# EasyEDA Pro project pcb easy eda pro stm32wb5mmg01 - Elektor.eprj, schematic Shield stm32wb5mm-dk
Create Date: 2023-10-27; Page Name: P1; Project Name: stm32wb5mmg01; Schematic Name: Shield stm32wb5mm-dk; Update Date: 2023-12-18; Company: A. ROMASZEWSKI; Drawed: EasyEDA Pro; Page Size: A4; Part Number: SHMMDK-002; Reviewed: EasyEDA Pro; Version: V0.1; attr-text: ADS1115 ADR I2C 0x76
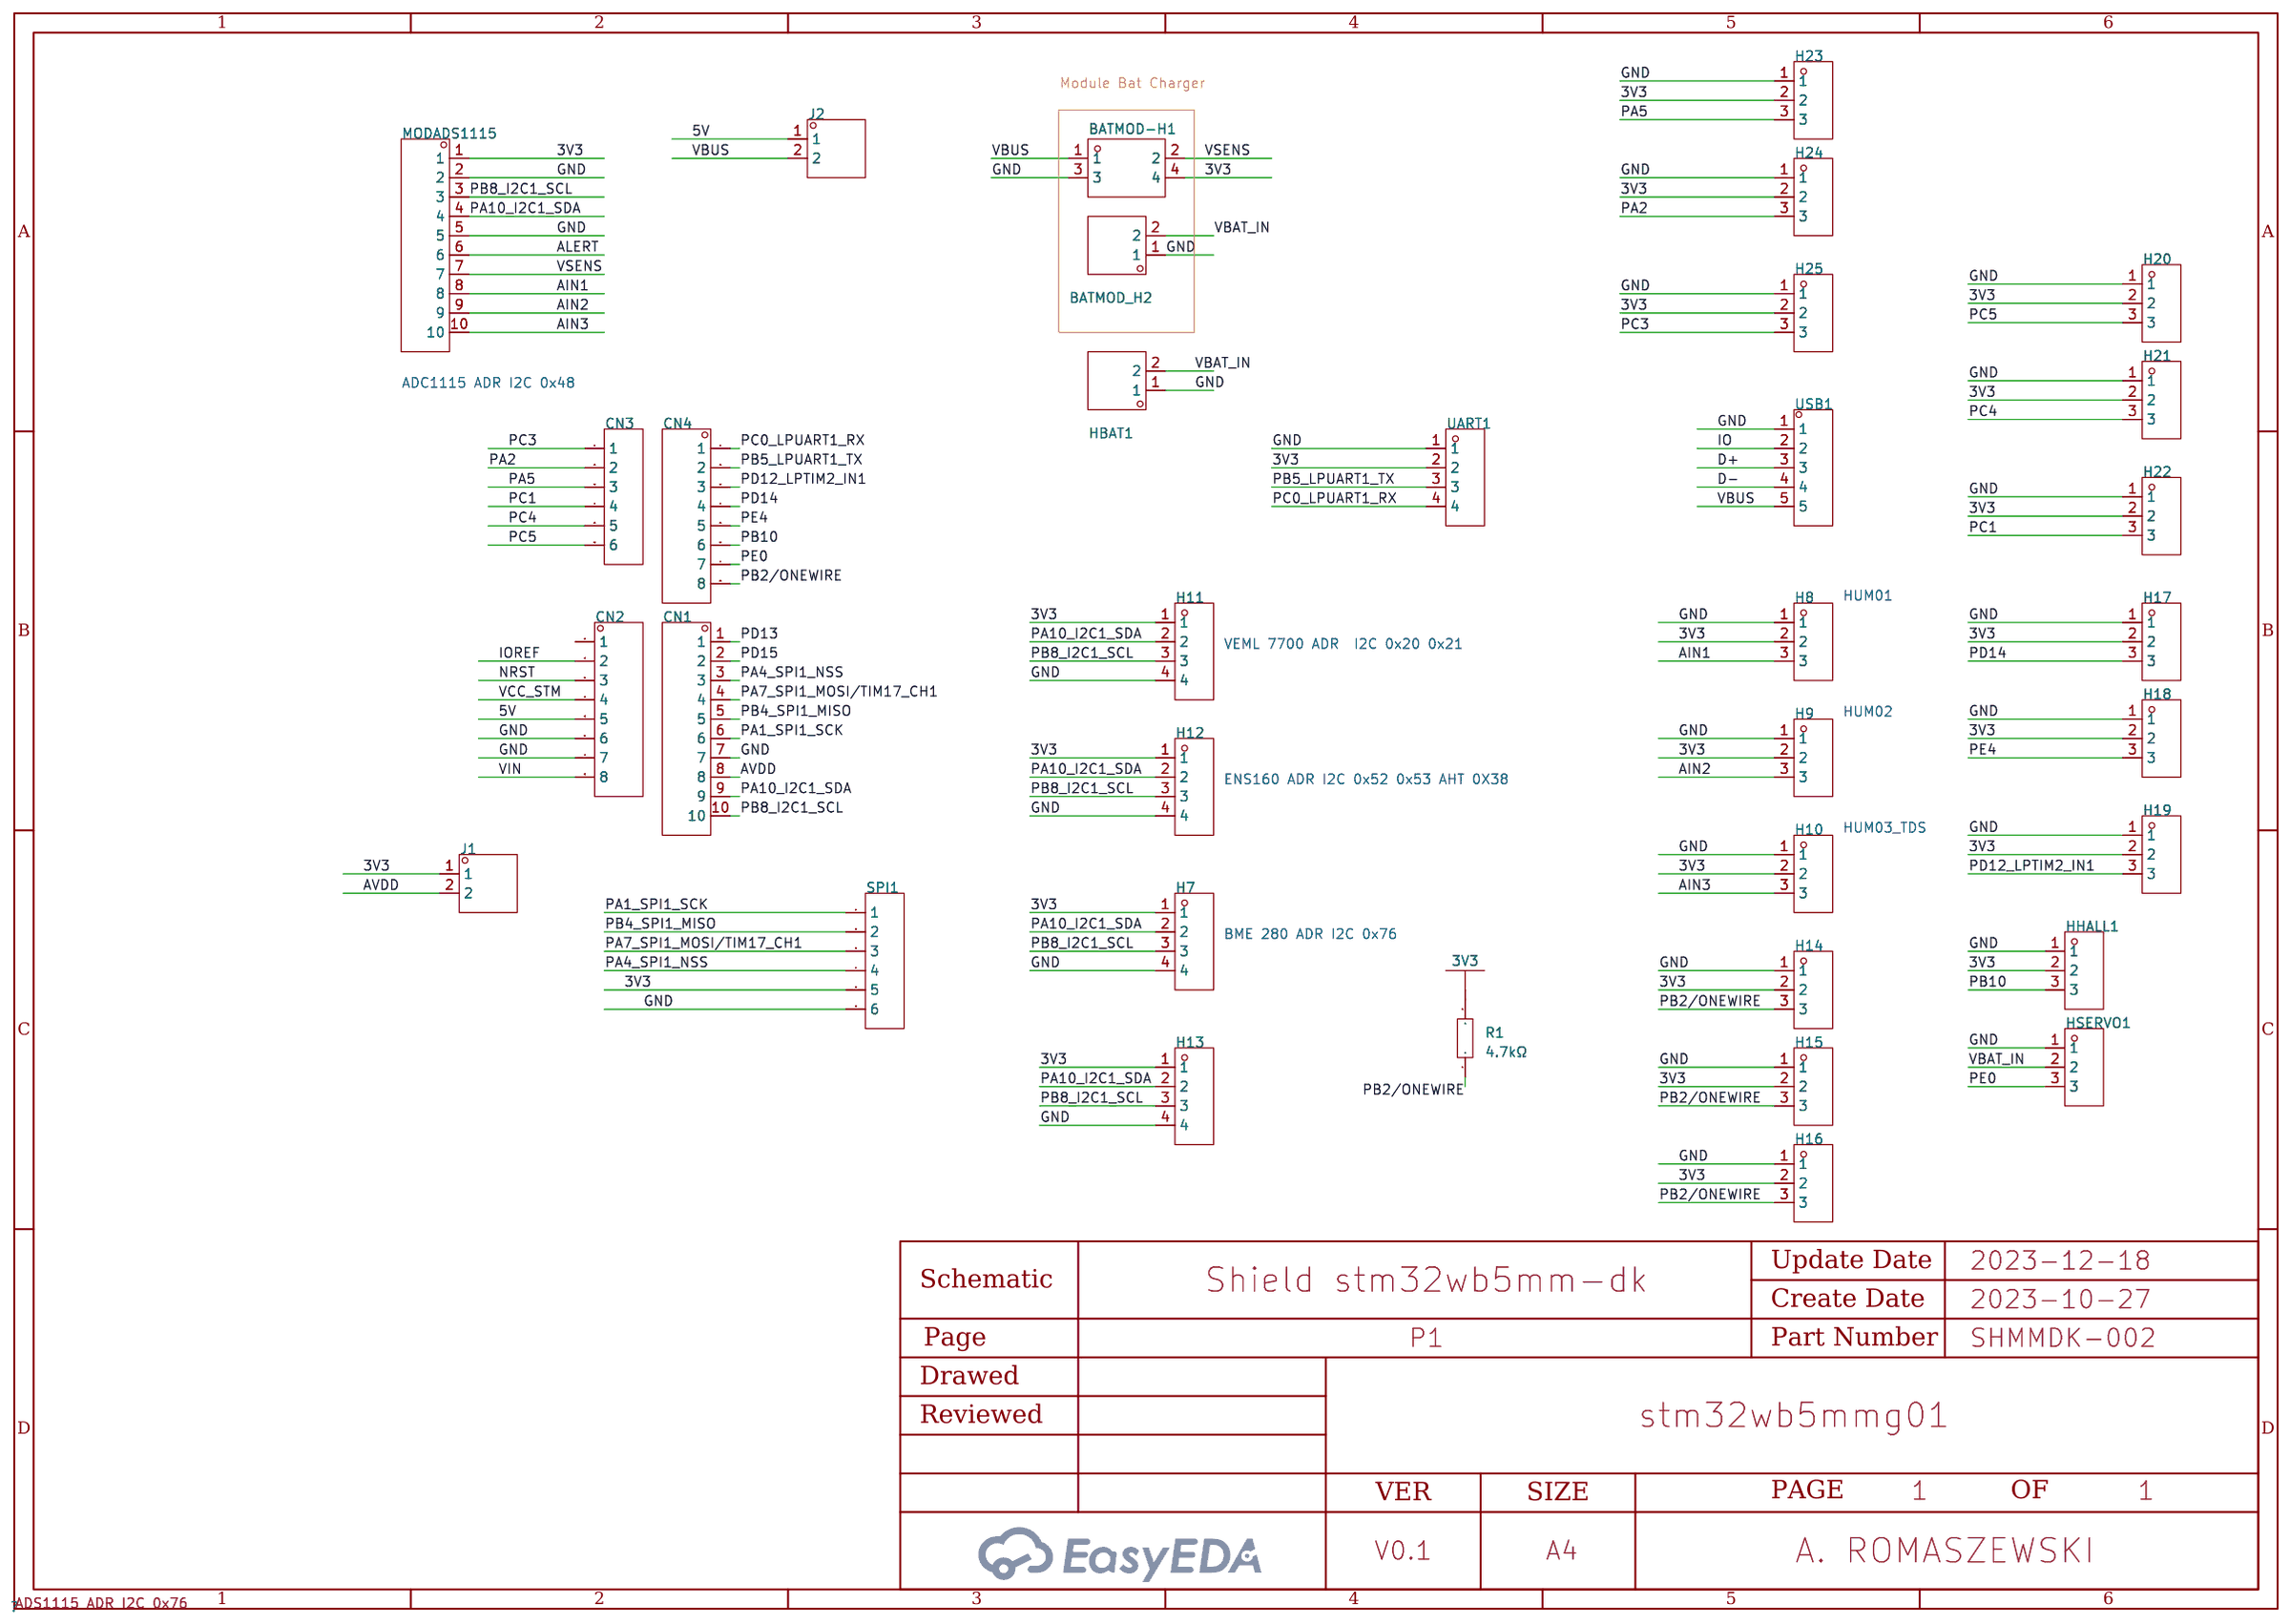
[diagram p1: schematic sheet]

## Parts
BATMOD-H1  -  [HDR-TH_4P-P2.54-V-M-R2-C2-S2.54-1]  (no BOM)
BATMOD_H2  -  [HDR-TH_2P-P2.54-V-M-1]  (no BOM)
CN1  -  [HDR-TH_10P-P2.54-V-M-1]  (no BOM)
CN2  -  [HDR-TH_8P-P2.54-V-M]  (no BOM)
CN3  -  [HDR-TH_6P-P2.54-V-M-1]  (no BOM)
CN4  -  [HDR-TH_8P-P2.54-V-M]  (no BOM)
H7  -  [HDR-TH_4P-P2.54-V-M]  (no BOM)
H8  -  [HDR-TH_3P-P2.54-V-M]  (no BOM)
H9  -  [HDR-TH_3P-P2.54-V-M]  (no BOM)
H10  -  [HDR-TH_3P-P2.54-V-M]  (no BOM)
H11  -  [HDR-TH_4P-P2.54-V-M]  (no BOM)
H12  -  [HDR-TH_4P-P2.54-V-M]  (no BOM)
H13  -  [HDR-TH_4P-P2.54-V-M]  (no BOM)
H14  -  [HDR-TH_3P-P2.54-V-M]  (no BOM)
H15  -  [HDR-TH_3P-P2.54-V-M]  (no BOM)
H16  -  [HDR-TH_3P-P2.54-V-M]  (no BOM)
H17  -  [HDR-TH_3P-P2.54-V-M]  (no BOM)
H18  -  [HDR-TH_3P-P2.54-V-M]  (no BOM)
H19  -  [HDR-TH_3P-P2.54-V-M]  (no BOM)
H20  -  [HDR-TH_3P-P2.54-V-M]  (no BOM)
H21  -  [HDR-TH_3P-P2.54-V-M]  (no BOM)
H22  -  [HDR-TH_3P-P2.54-V-M]  (no BOM)
H23  -  [HDR-TH_3P-P2.54-V-M]  (no BOM)
H24  -  [HDR-TH_3P-P2.54-V-M]  (no BOM)
H25  -  [HDR-TH_3P-P2.54-V-M]  (no BOM)
HBAT1  -  [HDR-TH_2P-P2.54-V-M-1]  (no BOM)
HHALL1  -  [HDR-TH_3P-P2.54-V-M]  (no BOM)
HSERVO1  -  [HDR-TH_3P-P2.54-V-M]  (no BOM)
J1  -  [HDR-TH_2P-P2.54-V-M-1]  (no BOM)
J2  -  [HDR-TH_2P-P2.54-V-M-1]  (no BOM)
MODADS1115  -  [HDR-TH_10P-P2.54-V-M-1]  (no BOM)
R1  4.7kΩ  [R1206]  (no BOM)
SPI1  -  [HDR-TH_6P-P2.54-V-M-1]  (no BOM)
UART1  -  [HDR-TH_4P-P2.54-V-M]  (no BOM)
USB1  -  [HDR-TH_5P-P2.54-V-M]  (no BOM)

## Library data of the parts
BATMOD-H1 = HDR-M_2.54_2x2: Supplier Footprint: Through
BATMOD_H2 HBAT1 J1 J2 = HDR-M_2.54_1x2P: Supplier Footprint: Through
CN1 MODADS1115 = HDR-M_2.54_1x10P: Supplier Footprint: Through
CN2 CN4 = HDR-M_2.54_1x8P: Supplier Footprint: Through
CN3 SPI1 = HDR-M_2.54_1x6P: Supplier Footprint: Through
H7 H11-H13 UART1 = HDR-M_2.54_1x4P: Supplier Footprint: Through
H8-H10 H14-H25 HHALL1 HSERVO1 = HDR-M_2.54_1x3P: Supplier Footprint: Through
R1 = Res_1206: Supplier Footprint: 1206
USB1 = HDR-M_2.54_1x5P: Supplier Footprint: Through

## Nets
3V3: BATMOD-H1.4 H7.1 H8.2 H9.2 H10.2 H11.1 H12.1 H13.1 H14.2 H15.2 H16.2 H17.2 H18.2 H19.2 H20.2 H21.2 H22.2 H23.2 H24.2 H25.2 HHALL1.2 J1.1 MODADS1115.1 R1.2 SPI1.5 UART1.2
5V: CN2.5 J2.1
AVDD: CN1.8 J1.2
GND: BATMOD-H1.3 BATMOD_H2.1 CN1.7 CN2.6 CN2.7 H7.4 H8.1 H9.1 H10.1 H11.4 H12.4 H13.4 H14.1 H15.1 H16.1 H17.1 H18.1 H19.1 H20.1 H21.1 H22.1 H23.1 H24.1 H25.1 HBAT1.1 HHALL1.1 HSERVO1.1 MODADS1115.2 MODADS1115.5 SPI1.6 UART1.1 USB1.1
VBAT_IN: BATMOD_H2.2 HBAT1.2 HSERVO1.2
VBUS: BATMOD-H1.1 J2.2 USB1.5
VCC_STM: CN2.4
VIN: CN2.8
AIN1: H8.3 MODADS1115.8
AIN2: H9.3 MODADS1115.9
AIN3: H10.3 MODADS1115.10
ALERT: MODADS1115.6
D+: USB1.3
D-: USB1.4
IO: USB1.2
IOREF: CN2.2
NRST: CN2.3
PA1_SPI1_SCK: CN1.6 SPI1.1
PA2: CN3.2 H24.3
PA4_SPI1_NSS: CN1.3 SPI1.4
PA5: CN3.3 H23.3
PA7_SPI1_MOSI/TIM17_CH1: CN1.4 SPI1.3
PA10_I2C1_SDA: CN1.9 H7.2 H11.2 H12.2 H13.2 MODADS1115.4
PB2/ONEWIRE: CN4.8 H14.3 H15.3 H16.3 R1.1
PB4_SPI1_MISO: CN1.5 SPI1.2
PB5_LPUART1_TX: CN4.2 UART1.3
PB8_I2C1_SCL: CN1.10 H7.3 H11.3 H12.3 H13.3 MODADS1115.3
PB10: CN4.6 HHALL1.3
PC0_LPUART1_RX: CN4.1 UART1.4
PC1: CN3.4 H22.3
PC3: CN3.1 H25.3
PC4: CN3.5 H21.3
PC5: CN3.6 H20.3
PD12_LPTIM2_IN1: CN4.3 H19.3
PD13: CN1.1
PD14: CN4.4 H17.3
PD15: CN1.2
PE0: CN4.7 HSERVO1.3
PE4: CN4.5 H18.3
VSENS: BATMOD-H1.2 MODADS1115.7

Not connected (* = marked no-connect by the designer): CN2 1

## Notes on the sheet
- Module Bat Charger
- ADC1115 ADR I2C 0x48
- HUM01
- VEML 7700 ADR  I2C 0x20 0x21
- HUM02
- ENS160 ADR I2C 0x52 0x53 AHT 0X38
- HUM03_TDS
- BME 280 ADR I2C 0x76
